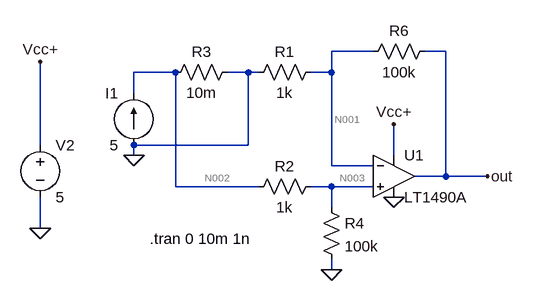
[diagram p0: schematic merac struje mppt.asc]
merac struje mppt.asc, the LTspice schematic file:
Version 4.1
SHEET 1 920 680
WIRE 336 96 272 96
WIRE 448 96 416 96
WIRE 32 128 -32 128
WIRE 144 128 112 128
WIRE 160 128 144 128
WIRE 272 128 272 96
WIRE 272 128 240 128
WIRE -32 160 -32 128
WIRE -176 240 -176 112
WIRE 144 240 144 128
WIRE 144 240 -32 240
WIRE -32 256 -32 240
WIRE 368 256 368 208
WIRE 272 272 272 128
WIRE 336 272 272 272
WIRE 448 288 448 96
WIRE 448 288 400 288
WIRE 512 288 448 288
WIRE 32 304 32 128
WIRE 160 304 32 304
WIRE 272 304 240 304
WIRE 336 304 272 304
WIRE 272 336 272 304
WIRE -176 368 -176 320
WIRE 272 432 272 416
FLAG 512 288 out
FLAG -176 368 0
FLAG 368 320 0
FLAG 272 432 0
FLAG 368 208 Vcc+
FLAG -176 112 Vcc+
FLAG -32 256 0
SYMBOL res 256 320 R0
SYMATTR InstName R4
SYMATTR Value 100k
SYMBOL res 432 80 R90
WINDOW 0 0 56 VBottom 2
WINDOW 3 32 56 VTop 2
SYMATTR InstName R6
SYMATTR Value 100k
SYMBOL voltage -176 224 R0
WINDOW 123 0 0 Left 0
WINDOW 39 0 0 Left 0
SYMATTR InstName V2
SYMATTR Value 5
SYMBOL res 256 112 R90
WINDOW 0 0 56 VBottom 2
WINDOW 3 32 56 VTop 2
SYMATTR InstName R1
SYMATTR Value 1k
SYMBOL res 256 288 R90
WINDOW 0 0 56 VBottom 2
WINDOW 3 32 56 VTop 2
SYMATTR InstName R2
SYMATTR Value 1k
SYMBOL res 128 112 R90
WINDOW 0 0 56 VBottom 2
WINDOW 3 32 56 VTop 2
SYMATTR InstName R3
SYMATTR Value 10m
SYMBOL OpAmps\\LT1490A 368 224 R0
SYMATTR InstName U1
SYMBOL current -32 240 R180
WINDOW 0 24 80 Left 2
WINDOW 3 24 0 Left 2
WINDOW 123 0 0 Left 0
WINDOW 39 0 0 Left 0
SYMATTR InstName I1
SYMATTR Value 5
TEXT -8 384 Left 2 !.tran 0 10m 1n

The netlist it stands for:
* merac struje mppt.asc
R4 N003 0 100k
R6 out N001 100k
V2 Vcc+ 0 5
R1 N001 0 1k
R2 N003 N002 1k
R3 0 N002 10m
X§U1 N003 N001 Vcc+ 0 out LT1490A  ; pins In+ In- V+ V- OUT
I1 0 N002 5
.tran 0 10m 1n
.backanno
.end

* Results of the author's LTspice run, read from the files saved beside the schematic
* Operating Point, zero values left out:
*   V(n001) = 49.28 mV
*   V(n002) = 50 mV
*   V(n003) = 49.51 mV
*   V(out) = 4.978 V
*   V(vcc+) = 5 V
*   I(I1) = 5 A
*   I(R1) = 49.28 µA
*   I(R2) = -493.1 nA
*   I(R3) = -5 A
*   I(R4) = 495.1 nA
*   I(R6) = 49.28 µA
*   I(V2) = -81.53 µA
*   Ix(u1:1) = -2.014 nA
*   Ix(u1:2) = -2.041 nA
*   Ix(u1:3) = 81.53 µA
*   Ix(u1:4) = -32.24 µA
*   Ix(u1:5) = -49.28 µA